# EAGLE design Whisker Stimulator (EAGLE 7.2.0)
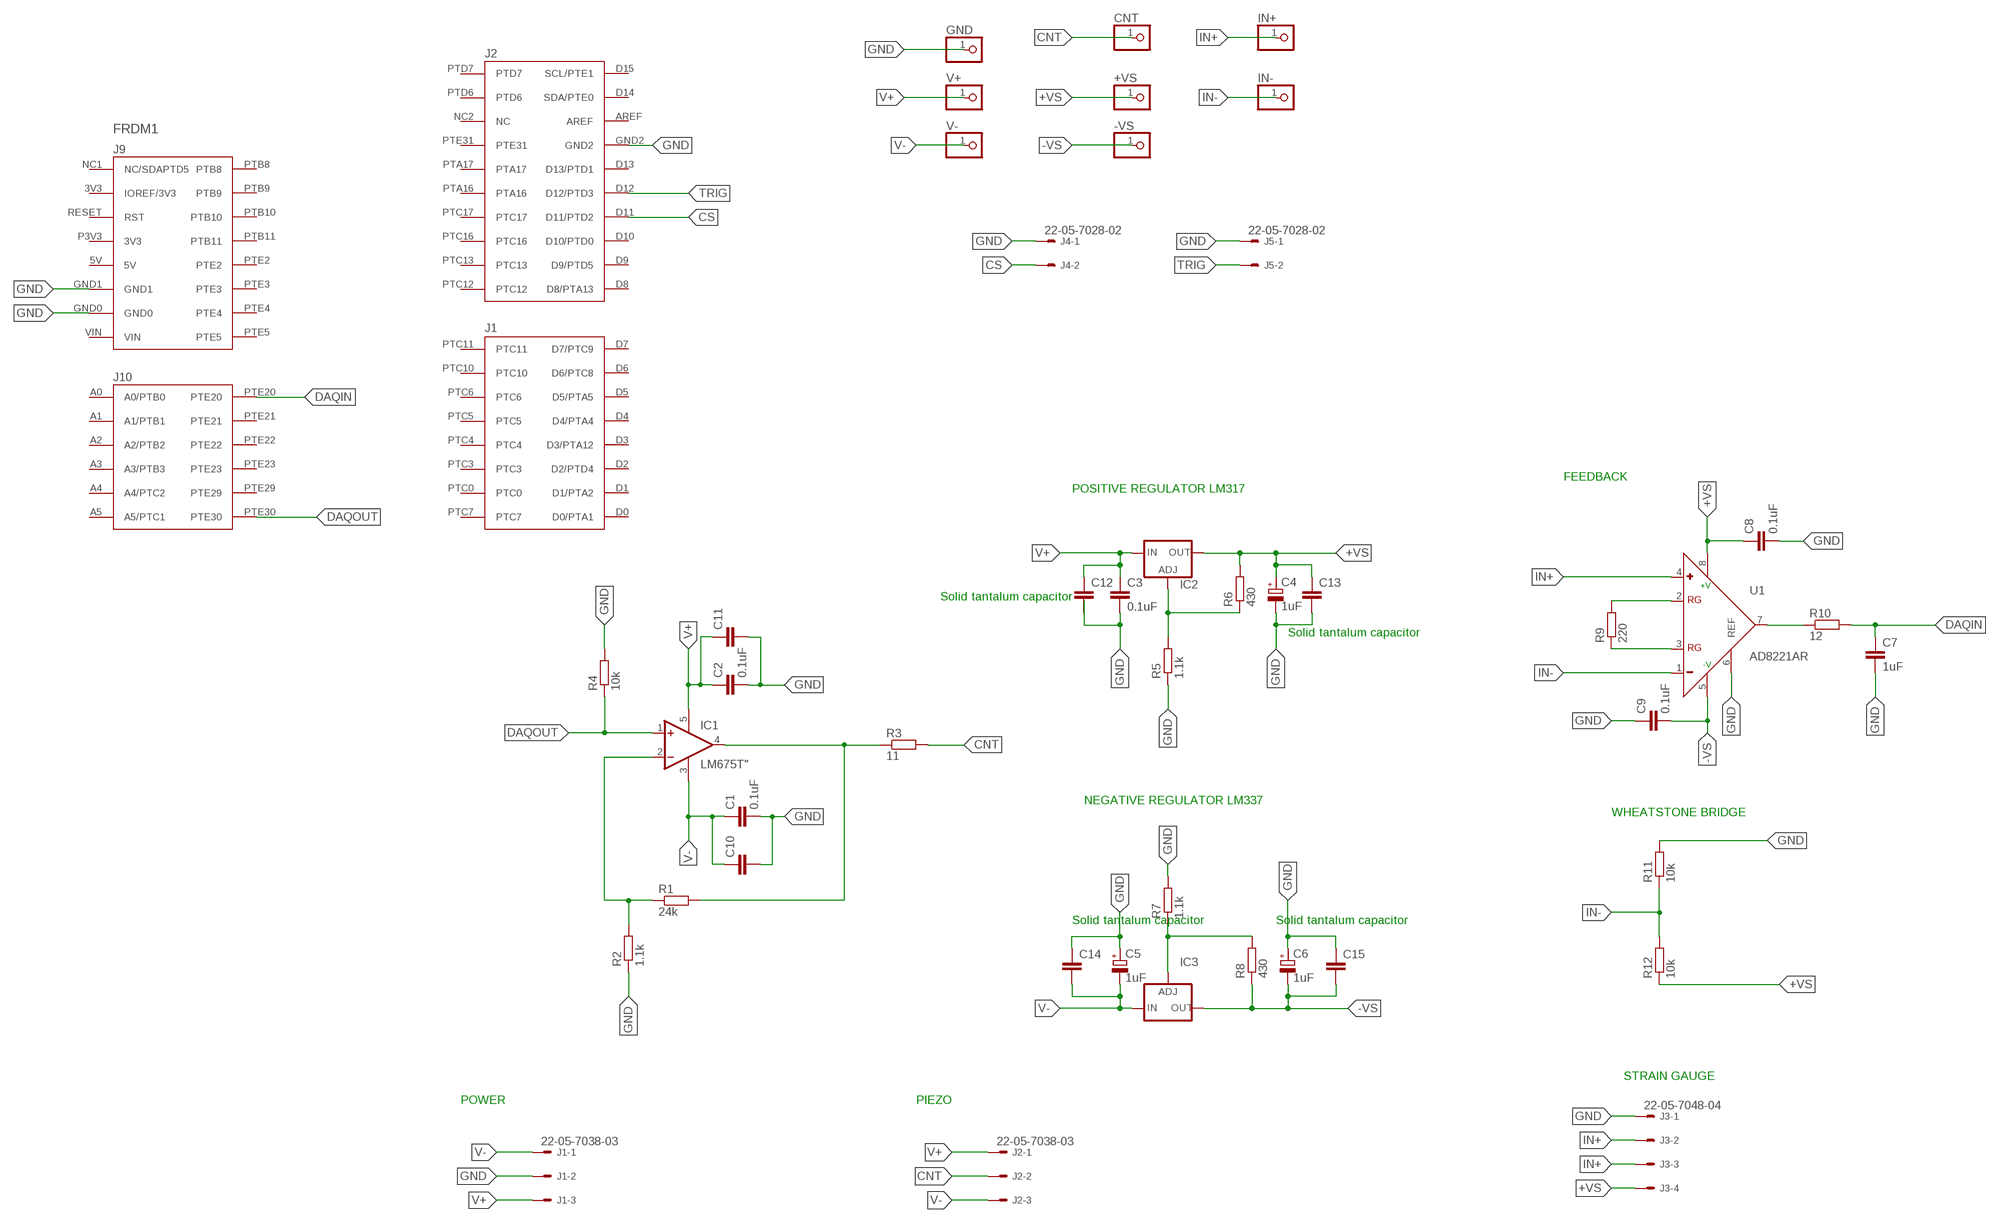
[diagram p0: schematic, sheet 1]

## Parts
+VS  PINHD-1X1  [1X01]
-VS  PINHD-1X1  [1X01]
C1  0.1uF  C-EUC0805  [C0805]
C2  0.1uF  C-EUC0805  [C0805]
C3  0.1uF  C-EUC0805  [C0805]
C4  1uF  CPOL-EUE2.5-4V  [E2,5RE]
C5  1uF  CPOL-EUE2.5-4V  [E2,5RE]
C6  1uF  CPOL-EUE2.5-4V  [E2,5RE]
C7  1uF  C-EUC0805  [C0805]
C8  0.1uF  C-EUC0805  [C0805]
C9  0.1uF  C-EUC0805  [C0805]
C10  0.1uF  C-EU050-024X044  [C050-024X044]
C11  0.1uF  C-EU050-024X044  [C050-024X044]
C12  0.1uF  C-EU050-024X044  [C050-024X044]
C13  0.1uF  C-EU050-024X044  [C050-024X044]
C14  0.1uF  C-EU050-024X044  [C050-024X044]
C15  0.1uF  C-EU050-024X044  [C050-024X044]
CNT  PINHD-1X1  [1X01]
FRDM1  FRDM-KL25ZNORMAL  [FRDM_KL25Z_NORMAL]
GND  PINHD-1X1  [1X01]
IC1  LM675T"  [CB360]
IC2  LM317TS  [317TS]
IC3  LM337TS  [337TS]
IN+  PINHD-1X1  [1X01]
IN-  PINHD-1X1  [1X01]
J1  22-05-7038-03  [7395-03]
J2  22-05-7038-03  [7395-03]
J3  22-05-7048-04  [7395-04]
J4  22-05-7028-02  [7395-02]
J5  22-05-7028-02  [7395-02]
R1  24k  R-EU_R0805  [R0805]
R2  1.1k  R-EU_R0805  [R0805]
R3  11  R-EU_VMTA55  [VMTA55]
R4  10k  R-EU_R0805  [R0805]
R5  1.1k  R-EU_R0805  [R0805]
R6  430  R-EU_R0805  [R0805]
R7  1.1k  R-EU_R0805  [R0805]
R8  430  R-EU_R0805  [R0805]
R9  220  R-EU_R0805  [R0805]
R10  12  R-EU_R0805  [R0805]
R11  10k  R-EU_R0805  [R0805]
R12  10k  R-EU_R0805  [R0805]
U1  AD8221AR  [SO8]
V+  PINHD-1X1  [1X01]
V-  PINHD-1X1  [1X01]

## Nets
+VS: +VS.1 C4.+ C8.1 C13.1 IC2.2(OUT) J3.4 R6.2 R12.1 U1.8(+V)
-VS: -VS.1 C6.- C9.2 C15.2 IC3.3(OUT) R8.1 U1.5(-V)
CNT: CNT.1 J2.2 R3.2
CS: FRDM1.D11(D11/PTD2) J4.2
DAQIN: C7.1 FRDM1.PTE20 R10.2
DAQOUT: FRDM1.PTE30 IC1.1(+IN) R4.1
GND: C1.2 C2.2 C3.2 C4.- C5.+ C6.+ C7.2 C8.2 C9.1 C10.2 C11.2 C12.2 C13.2 C14.1 C15.1 FRDM1.GND0 FRDM1.GND1 FRDM1.GND2 GND.1 J1.2 J3.1 J4.1 J5.1 R2.1 R4.2 R5.1 R7.2 R11.2 U1.6(REF)
IN+: IN+.1 J3.2 J3.3 U1.4(+)
IN-: IN-.1 R11.1 R12.2 U1.1(-)
N$1: IC2.1(ADJ) R5.2 R6.1
N$2: IC3.1(ADJ) R7.1 R8.2
N$3: IC1.4(OUT) R1.2 R3.1
N$4: IC1.2(-IN) R1.1 R2.2
N$5: R9.2 U1.2(RG)
N$6: R9.1 U1.3(RG)
N$7: R10.1 U1.7(OUT)
TRIG: FRDM1.D12(D12/PTD3) J5.2
V+: C2.1 C3.1 C11.1 C12.1 IC1.5(V+) IC2.3(IN) J1.3 J2.1 V+.1
V-: C1.1 C5.- C10.1 C14.2 IC1.3(V-) IC3.2(IN) J1.1 J2.3 V-.1
Unconnected: FRDM1.3V3(IOREF/3V3) FRDM1.5V FRDM1.A0(A0/PTB0) FRDM1.A1(A1/PTB1) FRDM1.A2(A2/PTB2) FRDM1.A3(A3/PTB3) FRDM1.A4(A4/PTC2) FRDM1.A5(A5/PTC1) FRDM1.AREF FRDM1.D0(D0/PTA1) FRDM1.D1(D1/PTA2) FRDM1.D2(D2/PTD4) FRDM1.D3(D3/PTA12) FRDM1.D4(D4/PTA4) FRDM1.D5(D5/PTA5) FRDM1.D6(D6/PTC8) FRDM1.D7(D7/PTC9) FRDM1.D8(D8/PTA13) FRDM1.D9(D9/PTD5) FRDM1.D10(D10/PTD0) FRDM1.D13(D13/PTD1) FRDM1.D14(SDA/PTE0) FRDM1.D15(SCL/PTE1) FRDM1.NC1(NC/SDAPTD5) FRDM1.NC2(NC) FRDM1.P3V3(3V3) FRDM1.PTA16 FRDM1.PTA17 FRDM1.PTB8 FRDM1.PTB9 FRDM1.PTB10 FRDM1.PTB11 FRDM1.PTC0 FRDM1.PTC3 FRDM1.PTC4 FRDM1.PTC5 FRDM1.PTC6 FRDM1.PTC7 FRDM1.PTC10 FRDM1.PTC11 FRDM1.PTC12 FRDM1.PTC13 FRDM1.PTC16 FRDM1.PTC17 FRDM1.PTD6 FRDM1.PTD7 FRDM1.PTE2 FRDM1.PTE3 FRDM1.PTE4 FRDM1.PTE5 FRDM1.PTE21 FRDM1.PTE22 FRDM1.PTE23 FRDM1.PTE29 FRDM1.PTE31 FRDM1.RESET(RST) FRDM1.VIN

## Notes on the sheet
- FEEDBACK
- POSITIVE REGULATOR LM317
- Solid tantalum capacitor
- Solid tantalum capacitor
- NEGATIVE REGULATOR LM337
- WHEATSTONE BRIDGE
- Solid tantalum capacitor | Solid tantalum capacitor
- STRAIN GAUGE
- POWER | PIEZO

## Library data of the parts
+VS -VS CNT GND IN+ IN- V+ V- = pinhead:PINHD-1X1: PIN HEADER
C1-C3 C7-C15 = rcl:C-EU: CAPACITOR, European symbol
C4-C6 = rcl:CPOL-EU: POLARIZED CAPACITOR, European symbol
FRDM1 = Freedom:FRDM-KL25Z: For creating FRDM-KL25Z shields
IC1 = linear:LM675T: Power OP AMP
IC2 = v-reg:LM317TS: VOLTAGE REGULATOR
IC3 = v-reg:LM337TS: VOLTAGE REGULATOR
J1 J2 = con-molex:22-?-03: CONNECTOR wire to board 2.54 mm (.1 inch) pitch header; OC_FARNELL: unknown; OC_NEWARK: unknown
J3 = con-molex:22-?-04: CONNECTOR wire to board 2.54 mm (.1 inch) pitch header; OC_FARNELL: unknown; OC_NEWARK: unknown
J4 J5 = con-molex:22-?-02: CONNECTOR wire to board 2.54 mm (.1 inch) pitch header; OC_FARNELL: 9731601; OC_NEWARK: unknown
R1-R12 = rcl:R-EU_: RESISTOR, European symbol
U1 = kblom:AD8221: Precision Instrumentation Amplifier Applications: Weigh scales Industrial process controls Bridge amplifiers Precision data acquisition systems Medical instrumentation Strain gages Transducer interfaces source <http://www.analog.com/static/imported-files/data_sheets/AD8221.pdf> inamp

## Board
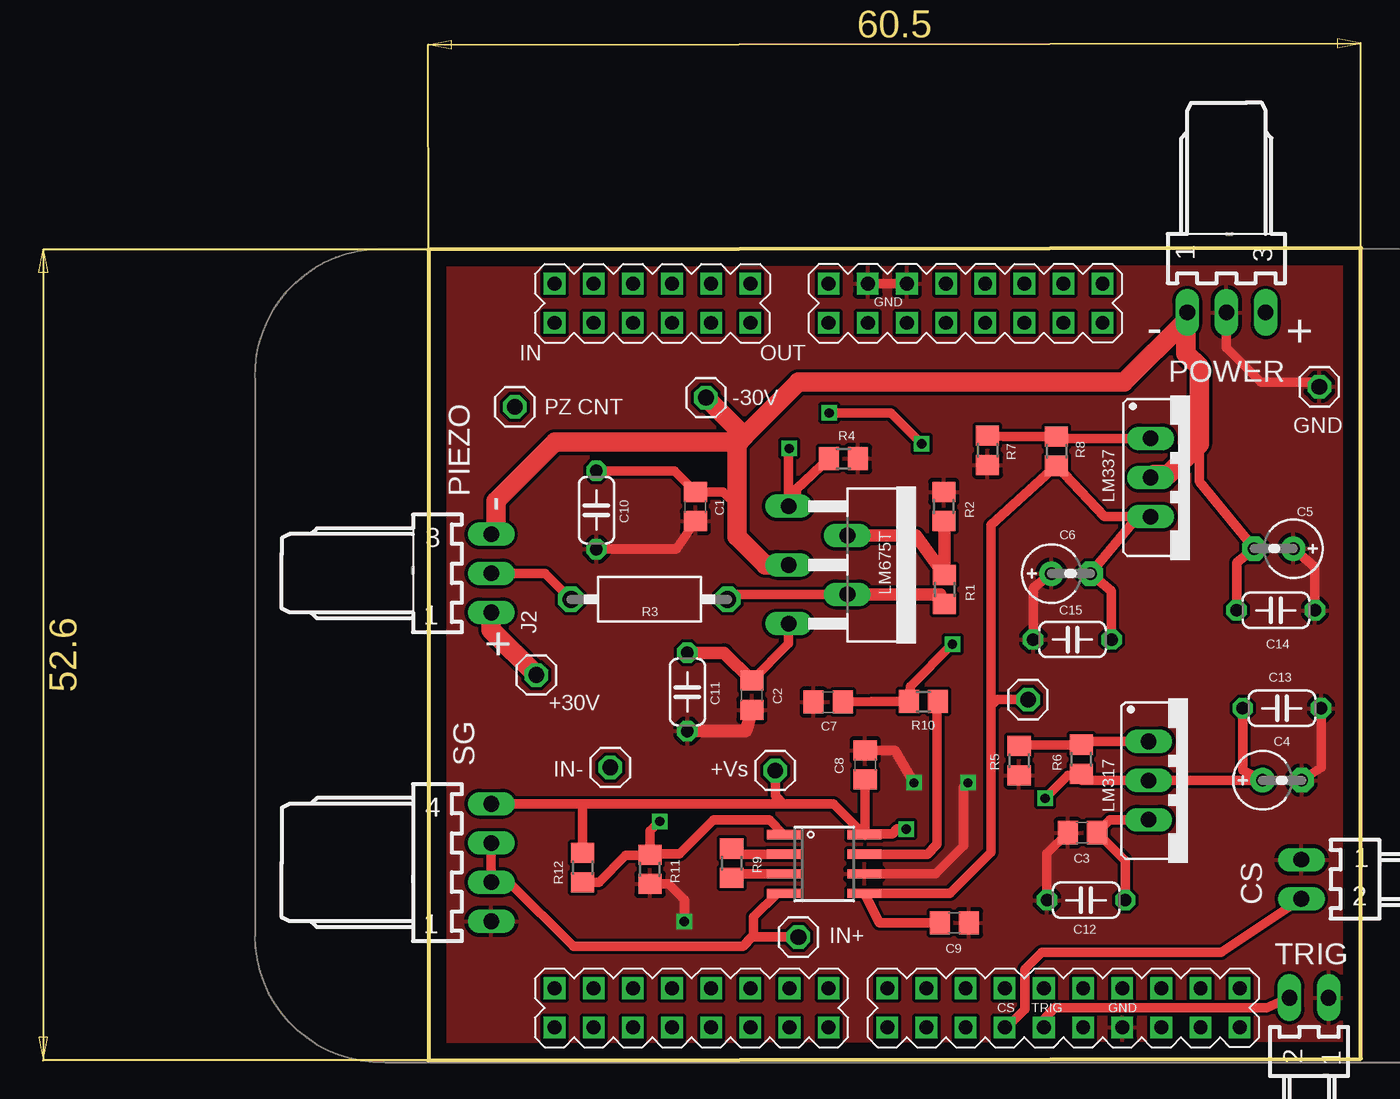
[diagram p1: board, top side]
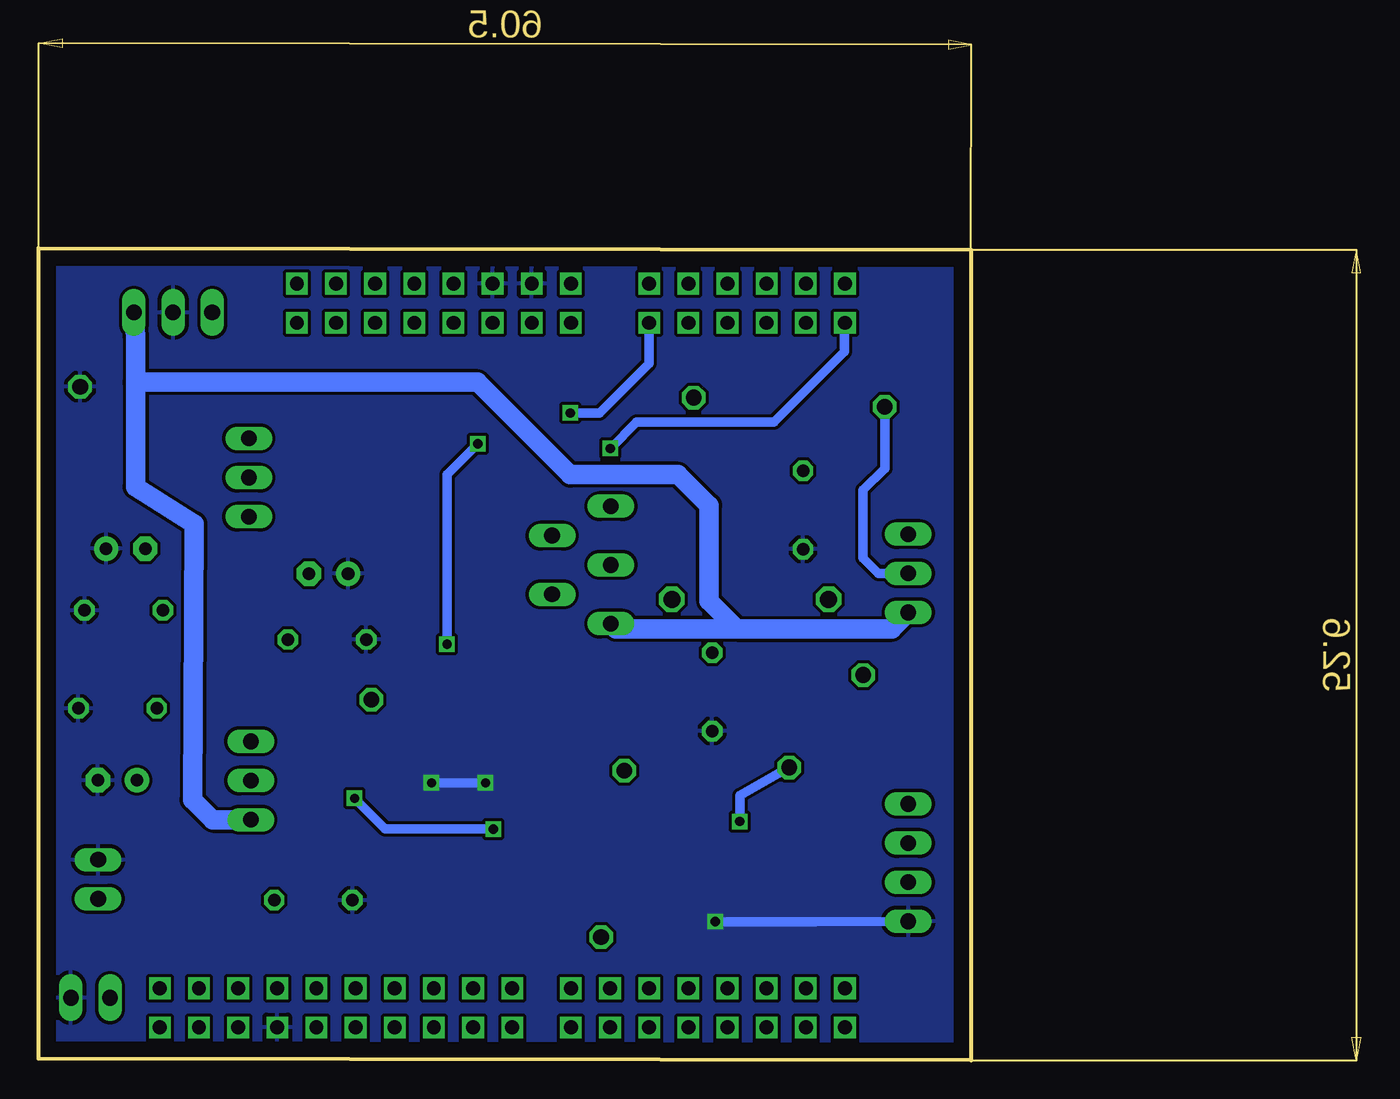
[diagram p2: board, bottom side, seen from below]

Size 60.5 x 52.7 mm. Coordinates in mm from the lower left corner, seen from the top.
Outline: 0,52.6 0,0 60.5,0.1 60.5,52.7 0,52.6
Copper layers (1*16): Top 0.035mm / dielectric 1.5mm / Bottom 0.035mm
Design rules "default": minimum track width 10mil, minimum drill 24mil, track to track 8mil, track to pad 8mil, pad to pad 8mil, via to via 8mil, smd to smd 8mil, copper to edge 40mil, drill to drill 8mil, minimum pad ring 10mil, minimum via ring 8mil, stop-mask expansion 4mil, vias tented up to drill 0mil, thermal gap 10mil

### Footprints (pad centres in the part's own frame; a part is rotated, then mirrored left to right if it is on the bottom)
1X01 = drill 1.016 octagon: 1 0,0
C0805 = smd 1.3 x 1.5: 1 -0.95,0; 2 0.95,0
E2,5RE = drill 0.813 pad 1.575: + -1.27,0 | drill 0.813 pad 1.575 octagon: - 1.27,0
C050-024X044 = drill 0.813 octagon: 1 -2.54,0; 2 2.54,0
FRDM_KL25Z_NORMAL = drill 0.9 square: 3V3 24.13,-15.24; 5V 24.13,-7.62; A0 24.13,5.08; A1 24.13,7.62; A2 24.13,10.16; A3 24.13,12.7; A4 24.13,15.24; A5 24.13,17.78; AREF -24.13,-21.59; D0 -24.13,17.78; D1 -24.13,15.24; D2 -24.13,12.7; D3 -24.13,10.16; D4 -24.13,7.62; D5 -24.13,5.08; D6 -24.13,2.54; D7 -24.13,0; D8 -24.13,-3.81; D9 -24.13,-6.35; D10 -24.13,-8.89; D11 -24.13,-11.43; D12 -24.13,-13.97; D13 -24.13,-16.51; D14 -24.13,-24.13; D15 -24.13,-26.67; GND0 24.13,-2.54; GND1 24.13,-5.08; GND2 -24.13,-19.05; NC1 24.13,-17.78; NC2 -21.59,-21.59; P3V3 24.13,-10.16; PTA16 -21.59,-13.97; PTA17 -21.59,-16.51; PTB8 21.59,-17.78; PTB9 21.59,-15.24; PTB10 21.59,-12.7; PTB11 21.59,-10.16; PTC0 -21.59,15.24; PTC3 -21.59,12.7; PTC4 -21.59,10.16; PTC5 -21.59,7.62; PTC6 -21.59,5.08; PTC7 -21.59,17.78; PTC10 -21.59,2.54; PTC11 -21.59,0; PTC12 -21.59,-3.81; PTC13 -21.59,-6.35; PTC16 -21.59,-8.89; PTC17 -21.59,-11.43; PTD6 -21.59,-24.13; PTD7 -21.59,-26.67; PTE2 21.59,-7.62; PTE3 21.59,-5.08; PTE4 21.59,-2.54; PTE5 21.59,0; PTE20 21.59,5.08; PTE21 21.59,7.62; PTE22 21.59,10.16; PTE23 21.59,12.7; PTE29 21.59,15.24; PTE30 21.59,17.78; PTE31 -21.59,-19.05; RESET 24.13,-12.7; VIN 24.13,0
CB360 = drill 1.016 long: 1 -3.81,-8.255; 2 -1.905,-4.445; 3 0,-8.255; 4 1.905,-4.445; 5 3.81,-8.255
317TS = drill 1.016 long: 1 -2.54,-2.54; 2 0,-2.54; 3 2.54,-2.54
337TS = drill 1.016 long: 1 -2.54,-2.54; 2 0,-2.54; 3 2.54,-2.54
7395-03 = drill 1.016 long: 1 2.54,0; 2 0,0; 3 -2.54,0
7395-04 = drill 1.016 long: 1 3.81,0; 2 1.27,0; 3 -1.27,0; 4 -3.81,0
7395-02 = drill 1.016 long: 1 1.27,0; 2 -1.27,0
R0805 = smd 1.3 x 1.5: 1 -0.95,0; 2 0.95,0
VMTA55 = drill 1.1 octagon: 1 -5.08,0; 2 5.08,0
SO8 = smd 0.6 x 2.2: 1 -1.905,-2.6; 2 -0.635,-2.6; 3 0.635,-2.6; 4 1.905,-2.6; 5 1.905,2.6; 6 0.635,2.6; 7 -0.635,2.6; 8 -1.905,2.6

### Placement (x,y rotation side)
+VS  22.5,18.8 0 top
-VS  38.9,23.4 0 top
C1  17.32,35.93 270 top
C2  20.98,23.69 270 top
C3  42.43,14.77 180 top
C4  55.38,18.17 0 top
C5  54.84,33.2 180 top
C6  41.68,31.58 0 top
C7  25.93,23.24 180 top
C8  28.33,19.17 90 top
C9  34.12,8.92 180 top
C10  10.9,35.7 270 top
C11  16.8,23.9 270 top
C12  42.67,10.39 180 top
C13  55.37,22.84 0 top
C14  54.98,29.2 180 top
C15  41.78,27.3 0 top
CNT  5.6,42.4 0 top
FRDM1  25.96,26.26 90 top
GND  57.8,43.7 0 top
IC1  31.63,32.14 270 top
IC2  49.27,18.15 270 top
IC3  49.4,37.81 270 top
IN+  24,8 0 top
IN-  11.8,19 0 top
J1  51.77,48.53 180 top
J2  4.07,31.6 270 top
J3  4.07,12.83 270 top
J4  56.63,11.75 90 top
J5  57.13,4.06 0 top
R1  33.48,30.55 270 top
R2  33.44,35.93 270 top
R3  14.33,29.91 180 top
R4  26.92,39.04 0 top
R5  38.32,19.45 90 top
R6  42.35,19.53 270 top
R7  36.27,39.59 270 top
R8  40.74,39.53 90 top
R9  19.67,12.78 90 top
R10  32.11,23.27 180 top
R11  14.37,12.39 270 top
R12  10,12.51 270 top
U1  25.67,12.73 270 top
V+  7,25 0 top
V-  18,43 0 top

### Tracks (layer width: path | path; a pad name or v marks a point on that pad's centre or on a via)
+VS  (via drill 0.6)
  Top 0.61: J3.4 10,16.64 | 10,16.64 23,16.64 | 23,16.64 26.27,16.64 U1.8 | U1.8 28.31,14.6 28.31,15.5 C8.1 | v40,17 41.48,18.48 R6.2 42.38,18.15 IC2.2 51.5,18.15 C4.+ 52.83,18.82 C13.1 | v31,15 30.4,15 30.1,14.7 28.33,14.7 U1.8 | R12.1 10,16.64 | +VS.1 22.5,17.14 23,16.64
  Bottom 0.61: v40,17 38,15 v31,15
-VS
  Top 0.61: C9.2 29.27,8.92 U1.5 33.83,10.83 36.5,13.5 36.5,23 | C15.2 44.32,30.44 C6.- 46.03,35.27 IC3.3 43.85,35.27 R8.1 36.5,34.73 36.5,23 | -VS.1 36.9,23.4 36.5,23
CNT
  Top 0.61: J2.2 7.56,31.6 R3.2
  Bottom 0.61: J2.2 6,31.6 7,32.6 7,37 5.6,38.4 CNT.1
CS
  Top 0.61: FRDM1.D11 37.53,2.13 38.7,3.3 38.7,5.9 39.8,7 51.45,7 J4.2
DAQIN  (via drill 0.6)
  Top 0.61: C7.1 28.75,23.27 R10.2 31.26,24.26 v34,27 | v32,40 30,42 v26,42
  Bottom 0.61: v34,27 34,38 v32,40 | v26,42 24.1,42 20.9,45.2 20.9,47.83 FRDM1.PTE20
DAQOUT  (via drill 0.6)
  Top 0.61: v23.4,39.7 23.37,39.67 IC1.1 23.88,35.95 23.88,37.05 R4.1
  Bottom 0.61: FRDM1.PTE30 8.2,47.83 8.2,46 12.8,41.4 21.7,41.4 v23.4,39.7
GND  (via drill 0.6)
  Top 0.61: C12.2 40.13,13.42 C3.2 | C13.2 57.91,19 C4.- | C15.1 39.24,30.63 C6.+ | C14.1 57.52,32.02 C5.+ | C10.2 16.1,33.16 C1.2 | U1.6 32.9,12.1 34.7,13.9 34.7,17.7 v35,18 | v31.5,18 30.25,20.1 C8.2 | J1.2 51.77,46.23 54,44 57.5,44 GND.1 | FRDM1.GND0 FRDM1.GND1 | R11.2 15.56,11.44 16.6,10.4 v16.6,9
  Top 0.813: C11.2 20.6,21.36 C2.2
  Bottom 0.61: v16.6,9 10.09,9 J3.1 | v35,18 v31.5,18
  pour Bottom: -7,53 61,53 61,0 -7,0
  pour Top: -4,0 61,0 61,52.7 -4,52.7
IN+
  Top 0.61: IN+.1 21.2,8 | 21.2,8 21,8 20.4,7.4 14,7.4 13.5,7.4 9.4,7.4 5.24,11.56 J3.2 J3.3 | U1.4 22.63,10.83 21.1,9.3 21.1,8.1 21.2,8
IN-  (via drill 0.6)
  Top 0.61: U1.1 22.11,15.6 18.5,15.6 16.3,13.4 14.43,13.4 R11.1 | R11.1 14.37,14.87 v15,15.5 | R12.2 11.06,11.56 12.8,13.3 14.33,13.3 R11.1
  Bottom 0.61: v15,15.5 15,17.2 IN-.1
N$1
  Top 0.61: IC2.1 42.56,20.69 R6.1 38.5,20.48 R5.2
N$2
  Top 0.61: IC3.1 40.47,40.35 R8.2 37.31,40.48 R7.1
N$3
  Top 0.61: IC1.4 19.73,30.24 R3.1
  Top 0.813: IC1.4 33.21,30.24 R1.2
N$4
  Top 0.813: IC1.2 31.63,34.05 R1.1 33.48,35.04 R2.2
N$5
  Top 0.61: U1.2 19.74,13.37 R9.2
N$6
  Top 0.61: U1.3 19.84,12.1 R9.1
N$7
  Top 0.61: U1.7 32.37,13.37 33,14 33,23.24 R10.1
TRIG
  Top 0.61: FRDM1.D12 39.93,2.63 40.6,3.4 54.4,3.4 J5.2
V+
  Top 0.61: IC2.3 44.22,15.61 C3.1 45.21,12.94 C12.1 | IC1.5 23.37,27.04 C2.1
  Top 0.813: C11.1 19.18,26.44 C2.1
  Top 1.27: J2.1 4.07,27.93 V+.1
  Bottom 1.27: J1.3 54.21,47 54.21,44 | 54.21,44 54.21,37.21 50.4,34.8 50.5,16.9 49.2,15.6 46.74,15.6 IC2.3 | 54.21,44 32,44 26,38 19,38 17,36 17,29.8 15.2,28 | 15.2,28 5.13,28 J2.1 | 15.2,28 23.04,28 IC1.5
V-
  Top 0.61: 50,40 50,37.54 C5.- 52.44,32.29 C14.2 | C10.1 15.96,38.24 C1.1 19.12,36.88 20,36
  Top 1.27: J1.1 49.13,48 | IC3.2 47.05,38 48,38 50,40 50,45 49.13,45.87 49.13,48 | IC1.3 21.86,32.14 20,34 20,36 20,40 | 20,40 20.5,40.5 | 20.5,40.5 24,44 45.13,44 49.13,48 | V-.1 20.5,40.5 | 20,40 19.9,40.1 8.2,40.1 4.4,36.3 4.4,34.47 J2.3

### Text on the board
tPlace: GND | - | + | IN | OUT | POWER | PZ CNT | -30V | GND | PIEZO | - | LM337 | LM675T | + | +30V | SG | IN- | +Vs | LM317 | CS | IN+ | TRIG | CS | TRIG | GND
tDocu: -Vs